# Altium schematic sheet Misc_Periph.SchDoc
size A4
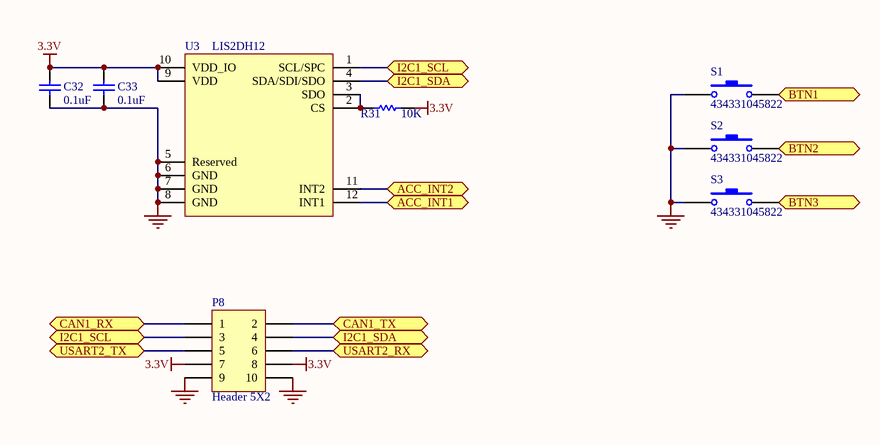
[diagram p0: Misc_Periph.SchDoc]

## Parts
C32  value 0.1uF  [CAPC2012N]  (hidden comment: Cap)
C33  value 0.1uF  [CAPC2012N]  (hidden comment: Cap)
P8  Header 5X2  [HDR2X5]
R31  value 10K  [RESC2012N]  (hidden comment: 1206)
S1  434331045822  [434331045822]
S2  434331045822  [434331045822]
S3  434331045822  [434331045822]
U3  LIS2DH12  [LGA12C50P4X4_200X200X100]

## Ports
ACC_INT1 (bidir), ACC_INT2 (bidir), BTN1 (bidir), BTN2 (bidir), BTN3 (bidir), CAN1_RX (bidir), CAN1_TX (bidir), I2C1_SCL (bidir), I2C1_SDA (bidir), USART2_RX (bidir), USART2_TX (bidir)

## Nets
3.3V: C32.2 C33.2 P8.7 P8.8 R31.1 U3.9(VDD) U3.10(VDD_IO)
DGND: C32.1 C33.1 P8.9 P8.10 S1.1 S2.1 S3.1 U3.5(Reserved) U3.6(GND) U3.7(GND) U3.8(GND)
ACC_INT1: U3.12(INT1) ; port ACC_INT1
ACC_INT2: U3.11(INT2) ; port ACC_INT2
BTN1: S1.2 ; port BTN1
BTN2: S2.2 ; port BTN2
BTN3: S3.2 ; port BTN3
CAN1_RX: P8.1 ; port CAN1_RX
CAN1_TX: P8.2 ; port CAN1_TX
I2C1_SCL: P8.3 U3.1(SCL/SPC) ; port I2C1_SCL
I2C1_SDA: P8.4 U3.4(SDA/SDI/SDO) ; port I2C1_SDA
USART2_RX: P8.6 ; port USART2_RX
USART2_TX: P8.5 ; port USART2_TX
NetR31_2: R31.2 U3.2(CS) U3.3(SDO)

## Library data of the parts
C32 C33 = Cap: Capacitor
P8 = Header 5X2: Header, 5-Pin, Dual row
R31 = Res: Resistor
S1-S3 = SW-PB: Momentary Push Button
U3 = LIS2DH12: MEMS digital output motion sensor ultra-low-power high-performance 3-axis "femto" accelerometer